# EAGLE design 20180608-iot (EAGLE 9.3.1)
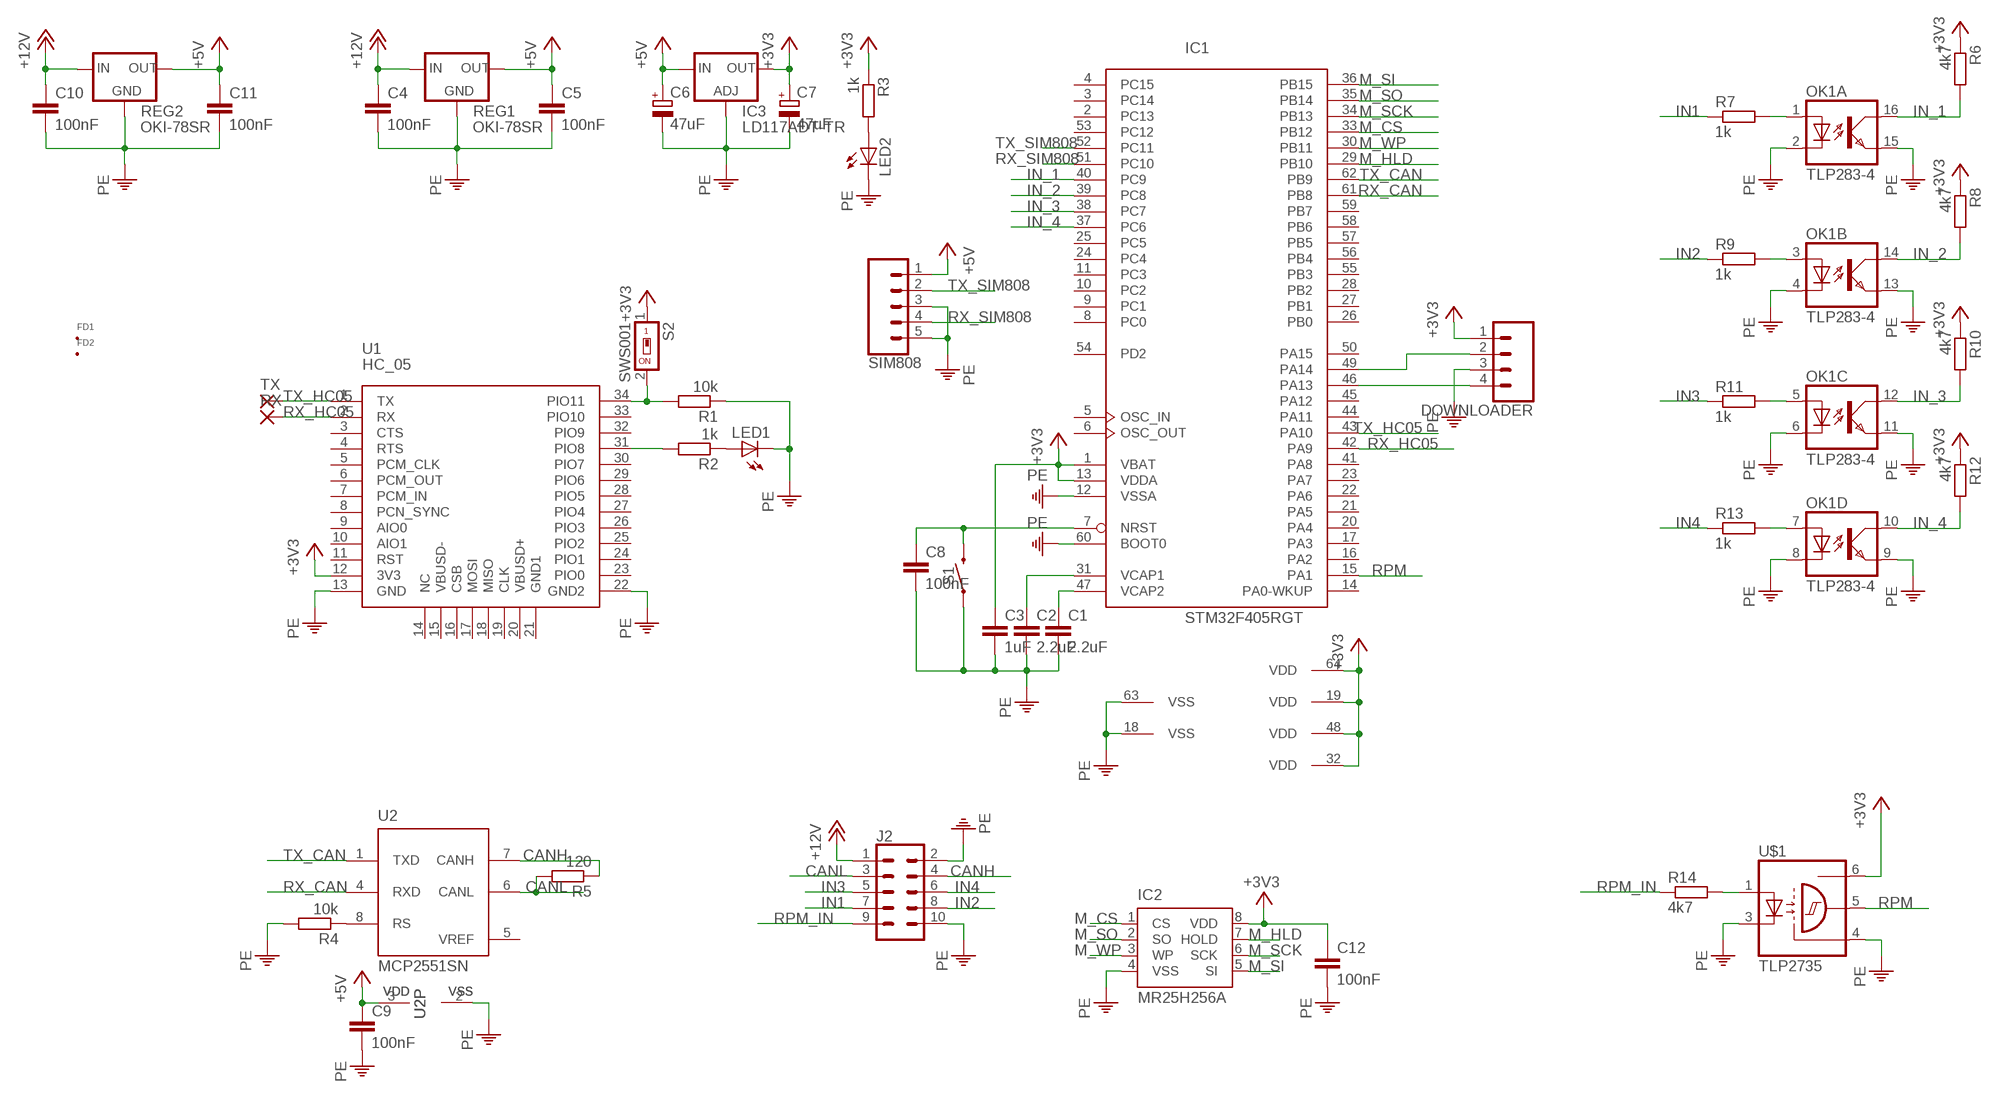
[diagram p0: schematic, sheet 1]

## Parts
C1  2.2uF  C-EUC0805  [C0805]
C2  2.2uF  C-EUC0805  [C0805]
C3  1uF  C-EUC0805  [C0805]
C4  100nF  C-EUC0805  [C0805]
C5  100nF  C-EUC0805  [C0805]
C6  47uF  CPOL-EUCT7343  [CT7343]
C7  47uF  CPOL-EUCT7343  [CT7343]
C8  100nF  C-EUC0805  [C0805]
C9  100nF  C-EUC0805  [C0805]
C10  100nF  C-EUC0805  [C0805]
C11  100nF  C-EUC0805  [C0805]
C12  100nF  C-EUC0805  [C0805]
DOWNLOADER  CONN_04  [1X04]
FD1  FID_40MIL  [FID_040]
FD2  FID_40MIL  [FID_040]
IC1  STM32F405RGT  [LQFP64]
IC2  MR25H256A  [SON127P600X500X90-9T210]
IC3  LD117ADT-TR  [DPACK]
J2  CONN_05X2  [2X5-EDGE_SMD]
LED1  LEDCHIP-LED0805  [CHIP-LED0805]
LED2  LEDCHIP-LED0805  [CHIP-LED0805]
OK1  TLP283-4  [MINI-FLAT-16]
R1  10k  R-EU_R0805  [R0805]
R2  1k  R-EU_R0805  [R0805]
R3  1k  R-EU_R0805  [R0805]
R4  10k  R-EU_R0805  [R0805]
R5  120  R-EU_R0805  [R0805]
R6  4k7  R-EU_R0805  [R0805]
R7  1k  R-EU_R0805  [R0805]
R8  4k7  R-EU_R0805  [R0805]
R9  1k  R-EU_R0805  [R0805]
R10  4k7  R-EU_R0805  [R0805]
R11  1k  R-EU_R0805  [R0805]
R12  4k7  R-EU_R0805  [R0805]
R13  1k  R-EU_R0805  [R0805]
R14  4k7  R-EU_R0805  [R0805]
REG1  OKI-78SR  [HDRV3W64P254_1X3_1195X508X838B]
REG2  OKI-78SR  [HDRV3W64P254_1X3_1195X508X838B]
RX  SMD2  [SMD1,27-2,54]
S1  MOMENTARY-SWITCH-SPST-SMD-6.0X3.5MM  [TACTILE_SWITCH_SMD_6.0X3.5MM]
S2  SWS001  [SMS-001]
SIM808  CONN_05  [1X05]
TX  SMD2  [SMD1,27-2,54]
U1  HC_05  [BLUETOOTH_SMD]
U2  MCP2551SN  [SO-08]
U$1  TLP2735  [SOIC127P1000X210-6]

## Nets
+3V3: C3.1 C7.+ C12.1 DOWNLOADER.1 IC1.1(VBAT) IC1.13(VDDA) IC1.19(VDD) IC1.32(VDD) IC1.48(VDD) IC1.64(VDD) IC2.8(VDD) IC3.4(OUT) R3.1 R6.1 R8.1 R10.1 R12.1 S2.1 U1.12(3V3) U$1.6(VCC)
+5V: C5.1 C6.+ C9.1 C11.1 IC3.3(IN) REG1.3(OUT) REG2.3(OUT) SIM808.1 U2.3(VDD)
+12V: C4.1 C10.1 J2.1 REG1.1(IN) REG2.1(IN)
CANH: J2.4 R5.1 U2.7(CANH)
CANL: J2.3 R5.2 U2.6(CANL)
IN1: J2.7 R7.1
IN2: J2.8 R9.1
IN3: J2.5 R11.1
IN4: J2.6 R13.1
IN_1: IC1.40(PC9) OK1.16(A:COL) R6.2
IN_2: IC1.39(PC8) OK1.14(B:COL) R8.2
IN_3: IC1.38(PC7) OK1.12(C:COL) R10.2
IN_4: IC1.37(PC6) OK1.10(D:COL) R12.2
M_CS: IC1.33(PB12) IC2.1(CS)
M_HLD: IC1.29(PB10) IC2.7(HOLD)
M_SCK: IC1.34(PB13) IC2.6(SCK)
M_SI: IC1.36(PB15) IC2.5(SI)
M_SO: IC1.35(PB14) IC2.2(SO)
M_WP: IC1.30(PB11) IC2.3(WP)
N$1: DOWNLOADER.2 IC1.49(PA14)
N$2: DOWNLOADER.4 IC1.46(PA13)
N$3: C1.1 IC1.47(VCAP2)
N$4: C2.1 IC1.31(VCAP1)
N$5: C8.1 IC1.7(NRST) S1.2
N$6: LED1.A R2.1
N$7: R1.2 S2.2 U1.34(PIO11)
N$8: R2.2 U1.31(PIO8)
N$9: LED2.A R3.2
N$10: R4.1 U2.8(RS)
N$13: OK1.1(A:A) R7.2
N$14: R14.2 U$1.1(A)
N$16: OK1.3(B:A) R9.2
N$18: OK1.5(C:A) R11.2
N$21: OK1.7(D:A) R13.2
PE: C1.2 C2.2 C3.2 C4.2 C5.2 C6.- C7.- C8.2 C9.2 C10.2 C11.2 C12.2 DOWNLOADER.3 IC1.12(VSSA) IC1.18(VSS) IC1.60(BOOT0) IC1.63(VSS) IC2.4(VSS) IC3.1(ADJ) J2.2 J2.10 LED1.C LED2.C OK1.2(A:C) OK1.4(B:C) OK1.6(C:C) OK1.8(D:C) OK1.9(D:EMIT) OK1.11(C:EMIT) OK1.13(B:EMIT) OK1.15(A:EMIT) R1.1 R4.2 REG1.2(GND) REG2.2(GND) S1.1 SIM808.3 SIM808.5 U1.13(GND) U1.22(GND2) U2.2(VSS) U$1.3(C) U$1.4(GND)
RPM: IC1.15(PA1) U$1.5(OUT)
RPM_IN: J2.9 R14.1
RX_CAN: IC1.61(PB8) U2.4(RXD)
RX_HC05: IC1.42(PA9) RX.1(P) U1.2(RX)
RX_SIM808: IC1.51(PC10) SIM808.4
TX_CAN: IC1.62(PB9) U2.1(TXD)
TX_HC05: IC1.43(PA10) TX.1(P) U1.1(TX)
TX_SIM808: IC1.52(PC11) SIM808.2
Unconnected: IC1.2(PC13) IC1.3(PC14) IC1.4(PC15) IC1.5(OSC_IN) IC1.6(OSC_OUT) IC1.8(PC0) IC1.9(PC1) IC1.10(PC2) IC1.11(PC3) IC1.14(PA0-WKUP) IC1.16(PA2) IC1.17(PA3) IC1.20(PA4) IC1.21(PA5) IC1.22(PA6) IC1.23(PA7) IC1.24(PC4) IC1.25(PC5) IC1.26(PB0) IC1.27(PB1) IC1.28(PB2) IC1.41(PA8) IC1.44(PA11) IC1.45(PA12) IC1.50(PA15) IC1.53(PC12) IC1.54(PD2) IC1.55(PB3) IC1.56(PB4) IC1.57(PB5) IC1.58(PB6) IC1.59(PB7) U1.3(CTS) U1.4(RTS) U1.5(PCM_CLK) U1.6(PCM_OUT) U1.7(PCM_IN) U1.8(PCN_SYNC) U1.9(AIO0) U1.10(AIO1) U1.11(RST) U1.14(NC) U1.15(VBUSD-) U1.16(CSB) U1.17(MOSI) U1.18(MISO) U1.19(CLK) U1.20(VBUSD+) U1.21(GND1) U1.23(PIO0) U1.24(PIO1) U1.25(PIO2) U1.26(PIO3) U1.27(PIO4) U1.28(PIO5) U1.29(PIO6) U1.30(PIO7) U1.32(PIO9) U1.33(PIO10)

## Power pins joined to a net without a drawn wire
VREF: U2.5(VREF)

## Library data of the parts
C1-C5 C8-C12 = rcl:C-EU: CAPACITOR, European symbol; SPICEPREFIX: C
C6 C7 = rcl:CPOL-EU: POLARIZED CAPACITOR, European symbol; SPICEPREFIX: C
DOWNLOADER = SparkFun-Connectors:CONN_04: Multi connection point. Often used as Generic Header-pin footprint for 0.1 inch spaced/style header connections On any of the 0.1 inch spaced packages, you can populate with these: Break Away Headers - Straight <https://www.sparkfun.com/products/116> (PRT-00116) Break Away Male Headers - Right Angle <https://www.sparkfun.com/products/553> (PRT-00553) Female Headers <https://www.sparkfun.com/products/115> (PRT-00115) Break Away Headers - Machine Pin <https://www.sparkfun.com/products/117> (PRT-00117) Break Away Female Headers - Swiss Machine Pin <https://www.sparkfun.com/products/743> (PRT-00743) For SCREWTERMINALS and SPRING TERMINALS visit here: Screw Terimnals on SparkFun.com <https://www.sparkfun.com/search/results?term=Screw+Terminals> (5mm/3.5mm/2.54mm spacing) This device is also useful as a general connection point to wire up your design to another part of your project. Our various solder wires solder well into these plated through hole pads. Hook-Up Wire - Assortment (Stranded, 22 AWG) <https://www.sparkfun.com/products/11375> (PRT-11375) Hook-Up Wire - Assortment (Solid Core, 22 AWG) <https://www.sparkfun.com/products/11367> (PRT-11367) View the entire wire category on our website here <https://www.sparkfun.com/categories/141> Special notes: Molex polarized connector foot print use with SKU : PRT-08231 with associated crimp pins and housings. 1MM SMD Version SKU: PRT-10208; PROD_ID: CONN-09696
FD1 FD2 = Fiducial A:FID: Fiducial marks. Top and Bottom copper with stop mask
IC1 = micro-stm_v3:STM32F405R*T: ARM 32-bit Cortex™-M3 CPU 168 MHz maximum frequency 1024 Kbytes of Flash memory 192 kbytes of SRAM 51 GPIOs 1.8 to 3.6 V application supply; SPICEPREFIX: X
IC2 = my:MR25H256A
IC3 = v-reg:LD117A?*: Low drop fixed and adjustable positive voltage regulators 1 A Source: http://www.st.com/stonline/products/literature/ds/7194/ld1117axx.pdf
J2 = edge-con:CONN_05X2: Multi connection point. Often used as Generic Header-pin footprint for 0.1 inch spaced/style header connections For AVR SPI programming port, see special device with nice symbol: "AVR_SPI_PROG_5x2.dev" You can populate with any combo of single row headers, but if you'd like an exact match, check these: 2x5 AVR ICSP Male Header <https://www.sparkfun.com/products/778> (PRT-00778) 2x5 Pin Shrouded Header <https://www.sparkfun.com/products/8506> (PRT-08506) On any of the 0.1 inch spaced packages, you can populate with these: Break Away Headers - Straight <https://www.sparkfun.com/products/116> (PRT-00116) Break Away Male Headers - Right Angle <https://www.sparkfun.com/products/553> (PRT-00553) Female Headers <https://www.sparkfun.com/products/115> (PRT-00115) Break Away Headers - Machine Pin <https://www.sparkfun.com/products/117> (PRT-00117) Break Away Female Headers - Swiss Machine Pin <https://www.sparkfun.com/products/743> (PRT-00743) Special note: the shrouded connector mates well with our 5x2 ribbon cables: 2x5 Pin IDC Ribbon Cable <https://www.sparkfun.com/products/8535> (PRT-08535)
LED1 LED2 = led:LED: LED OSRAM: - CHIPLED LG R971, LG N971, LY N971, LG Q971, LY Q971, LO R971, LY R971 LH N974, LH R974 LS Q976, LO Q976, LY Q976 LO Q996 - Hyper CHIPLED LW Q18S LB Q993, LB Q99A, LB R99A - SideLED LS A670, LO A670, LY A670, LG A670, LP A670 LB A673, LV A673, LT A673, LW A673 LH A674 LY A675 LS A676, LA A676, LO A676, LY A676, LW A676 LS A679, LY A679, LG A679 - Hyper Micro SIDELED® LS Y876, LA Y876, LO Y876, LY Y876 LT Y87S - SmartLED LW L88C, LW L88S LB L89C, LB L89S, LG L890 LS L89K, LO L89K, LY L89K LS L896, LA L896, LO L896, LY L896 - TOPLED LS T670, LO T670, LY T670, LG T670, LP T670 LSG T670, LSP T670, LSY T670, LOP T670, LYG T670 LG T671, LOG T671, LSG T671 LB T673, LV T673, LT T673, LW T673 LH T674 LS T676, LA T676, LO T676, LY T676, LB T676, LH T676, LSB T676, LW T676 LB T67C, LV T67C, LT T67C, LS T67K, LO T67K, LY T67K, LW E67C LS E67B, LA E67B, LO E67B, LY E67B, LB E67C, LV E67C, LT E67C LW T67C LS T679, LY T679, LG T679 LS T770, LO T770, LY T770, LG T770, LP T770 LB T773, LV T773, LT T773, LW T773 LH T774 LS E675, LA E675, LY E675, LS T675 LS T776, LA T776, LO T776, LY T776, LB T776 LHGB T686 LT T68C, LB T68C - Hyper Mini TOPLED® LB M676 - Mini TOPLED Santana® LG M470 LS M47K, LO M47K, LY M47K Source: http://www.osram.convergy.de LUXEON: - LUMILED® LXK2-PW12-R00, LXK2-PW12-S00, LXK2-PW14-U00, LXK2-PW14-V00 LXK2-PM12-R00, LXK2-PM12-S00, LXK2-PM14-U00 LXK2-PE12-Q00, LXK2-PE12-R00, LXK2-PE12-S00, LXK2-PE14-T00, LXK2-PE14-U00 LXK2-PB12-K00, LXK2-PB12-L00, LXK2-PB12-M00, LXK2-PB14-N00, LXK2-PB14-P00, LXK2-PB14-Q00 LXK2-PR12-L00, LXK2-PR12-M00, LXK2-PR14-Q00, LXK2-PR14-R00 LXK2-PD12-Q00, LXK2-PD12-R00, LXK2-PD12-S00 LXK2-PH12-R00, LXK2-PH12-S00 LXK2-PL12-P00, LXK2-PL12-Q00, LXK2-PL12-R00 Source: www.luxeon.com KINGBRIGHT: KA-3528ASYC Source: www.kingbright.com
OK1 = optocoupler:TLP283-4: TOSHIBA PHOTOCOUPLER GaAs IRED & PHOTO-TRANSISTOR Source: http://www.semicon.toshiba.co.jp/td/en/Opto/Photocoupler/en_20050928_TLP283_datasheet.pdf; OC_FARNELL: unknown; OC_NEWARK: unknown
R1-R14 = rcl:R-EU_: RESISTOR, European symbol; SPICEPREFIX: R
REG1 REG2 = my:OKI-78SR
RX TX = wirepad:SMD2: SMD PAD
S1 = SparkFun-Switches:MOMENTARY-SWITCH-SPST: Momentary Switch (Pushbutton) - SPST Normally-open (NO) SPST momentary switches (buttons, pushbuttons). Variants PTH-12MM - 12mm square, through-hole Momentary Pushbutton Switch - 12mm Square <https://www.sparkfun.com/products/9190> (COM-09190) PTH-6.0MM, PTH-6.0MM-KIT - 6.0mm square, through-hole Mini Pushbutton Switch <https://www.sparkfun.com/products/97> (COM-00097) KIT package intended for soldering kit's - only one side of pads' copper is exposed. PTH-RIGHT-ANGLE-KIT - Right-angle, through-hole Right Angle Tactile Button <https://www.sparkfun.com/products/10791> - Used on SparkFun BigTime Watch Kit <https://www.sparkfun.com/products/11734> SMD-12MM - 12mm square, surface-mount Tactile Button - SMD (12mm) <https://www.sparkfun.com/products/12993> (COM-12993) Used on SparkFun PicoBoard <https://www.sparkfun.com/products/11888> SMD-4.5MM - 4.5mm Square Trackball Switch Used on SparkFun Blackberry Trackballer Breakout <https://www.sparkfun.com/products/13169> SMD-4.6MMX2.8MM - 4.60mm x 2.80mm, surface mount Used on SparkFun SAMD21 Mini Breakout <https://www.sparkfun.com/products/13664> SMD-5.2MM, SMD-5.2-REDUNDANT - 5.2mm square, surface-mount Mini Pushbutton Switch - SMD <https://www.sparkfun.com/products/8720> (COM-08720) Used on Arduino Pro Mini <https://www.sparkfun.com/products/11114> REDUNDANT package connects both switch circuits together SMD-6.0X3.5MM - 6.0 x 3.5mm, surface mount Momentary Reset Switch SMD <https://www.sparkfun.com/products/8229> (COM-08229) SMD-6.2MM-TALL - 6.2mm square, surface mount Tactile Button - SMD (6mm) <https://www.sparkfun.com/products/12992> Used on SparkFun Digital Sandbox <https://www.sparkfun.com/products/12651> SMD-RIGHT-ANGLE - Right-angle, surface mount Used on SparkFun Block for Intel® Edison - Arduino <https://www.sparkfun.com/products/13036>; PROD_ID: SWCH-00815; SF_SKU: COM-08229
S2 = smd-special:SWS001: SMD Dip Switch 1 pol.
SIM808 = SparkFun-Connectors:CONN_05: Multi connection point. Often used as Generic Header-pin footprint for 0.1 inch spaced/style header connections On any of the 0.1 inch spaced packages, you can populate with these: Break Away Headers - Straight <https://www.sparkfun.com/products/116> (PRT-00116) Break Away Male Headers - Right Angle <https://www.sparkfun.com/products/553> (PRT-00553) Female Headers <https://www.sparkfun.com/products/115> (PRT-00115) Break Away Headers - Machine Pin <https://www.sparkfun.com/products/117> (PRT-00117) Break Away Female Headers - Swiss Machine Pin <https://www.sparkfun.com/products/743> (PRT-00743) For SCREWTERMINALS and SPRING TERMINALS visit here: Screw Terimnals on SparkFun.com <https://www.sparkfun.com/search/results?term=Screw+Terminals> (5mm/3.5mm/2.54mm spacing) This device is also useful as a general connection point to wire up your design to another part of your project. Our various solder wires solder well into these plated through hole pads. Hook-Up Wire - Assortment (Stranded, 22 AWG) <https://www.sparkfun.com/products/11375> (PRT-11375) Hook-Up Wire - Assortment (Solid Core, 22 AWG) <https://www.sparkfun.com/products/11367> (PRT-11367) View the entire wire category on our website here <https://www.sparkfun.com/categories/141> Special notes: Molex polarized connector foot print use with SKU : PRT-08231 with associated crimp pins and housings. 1MM SMD Version SKU: PRT-10208
U1 = Bluetooth HC-05:HC_05: HC-05 Bluetooth Module
U2 = microchip_can:MCP2551: High Speed CAN tranceiver; SPICEPREFIX: X
U$1 = tlp2735:TLP2735: The Toshiba TLP2735 consists of high-output GaAℓAs light-emitting diode coupled with a high-gain, high-speed photo detector. It is housed in a thin SO6L package of 2.3 mm (max). The TLP2735 has guaranteed the isolation voltage 5 kVrms and compliant with international safety standards for reinforced insulation. This product can operate in power supply voltage 9 V to 15 V with the maximum operating temperature of 125 C. Since TLP2735 has UVLO function, it can prevent false operation during VDD starting up or under low voltage condition. The detector has a totem-pole output stage with current sourcing and sinking capabilities. The TLP2735 has an internal Faraday shield that provides a guaranteed common-mode transient immunity of ±25 kV/µs.

## Board
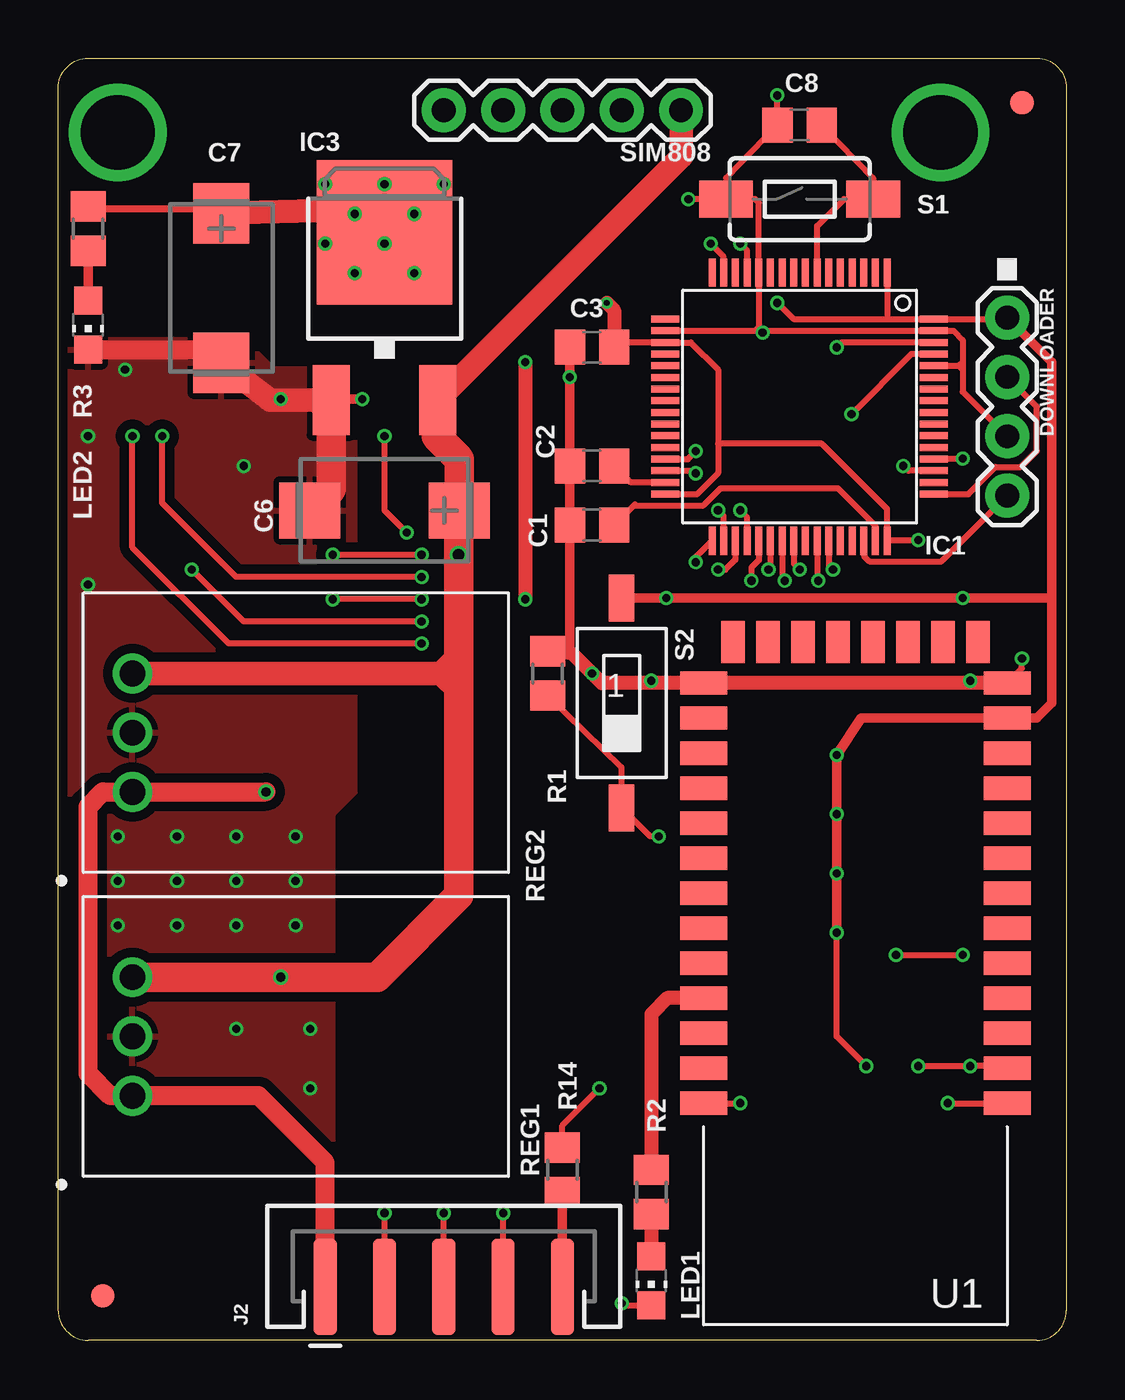
[diagram p1: board, top side]
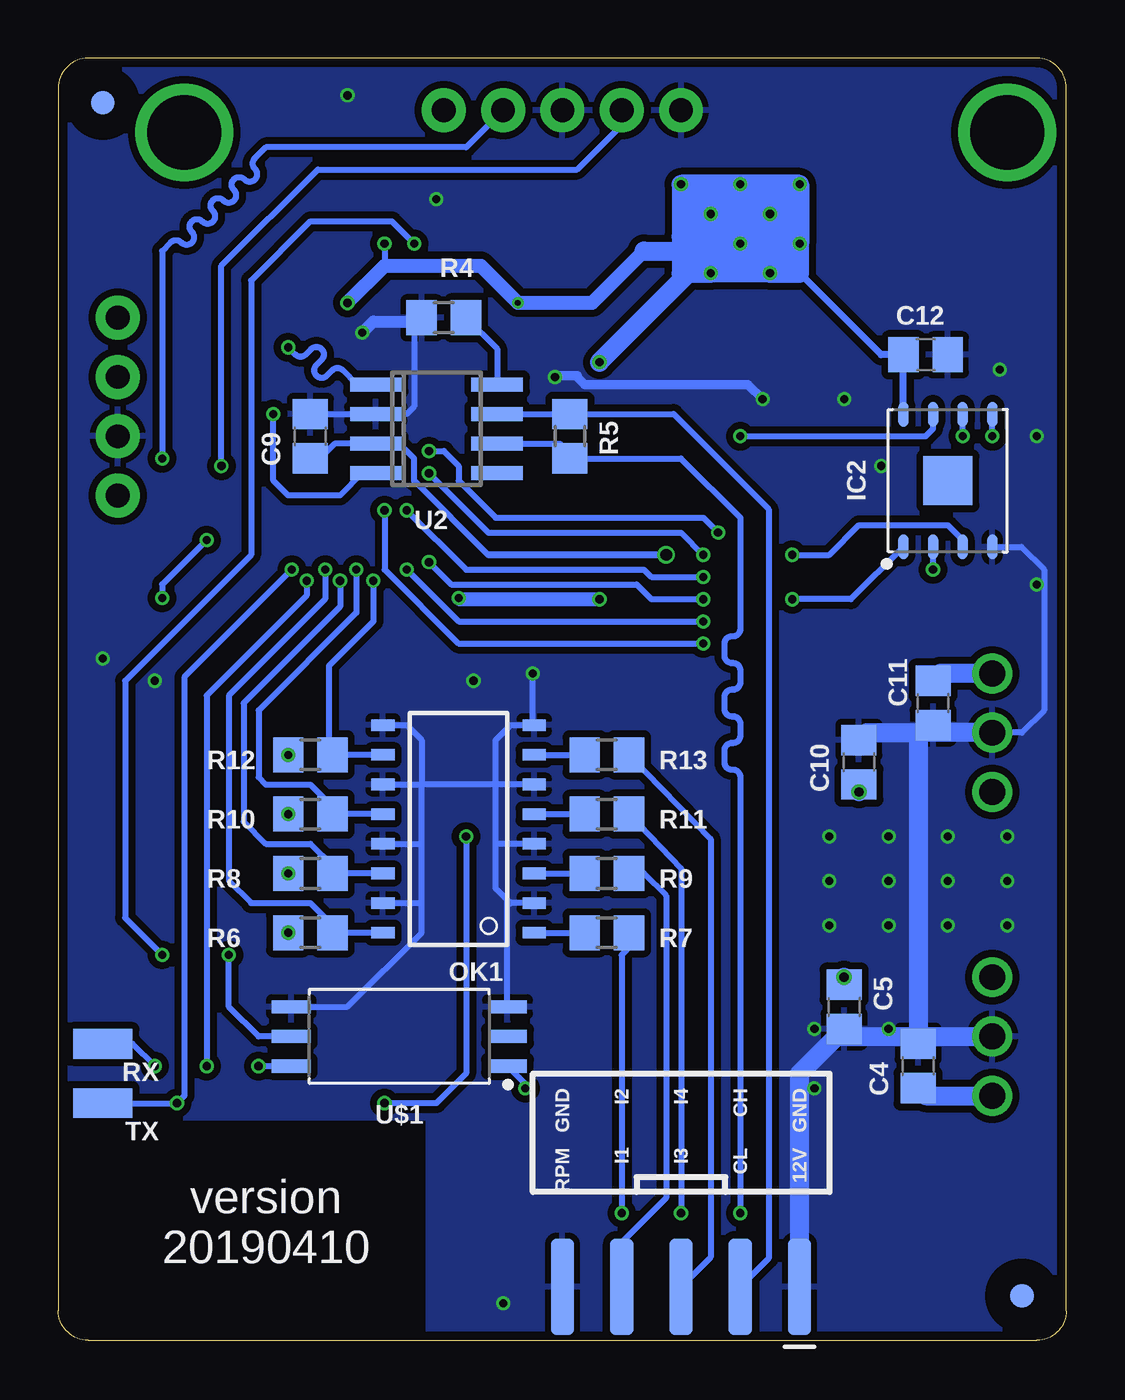
[diagram p2: board, bottom side, seen from below]

Size 43.18 x 54.93 mm. Coordinates in mm from the lower left corner, seen from the top.
Outline: 1.27,54.93 41.91,54.93 arc-90 43.18,53.66 43.18,1.27 arc-90 41.91,0 1.27,0 arc-90 0,1.27 0,53.66 arc-90 1.27,54.93
Copper layers (1*16): Top 0.035559375mm / dielectric 1.6mm / Bottom 0.035559375mm
Design rules "oshpark-2layer": minimum track width 6mil, minimum drill 10mil, track to track 6mil, track to pad 6mil, pad to pad 6mil, via to via 6mil, smd to smd 6mil, copper to edge 15mil, drill to drill 6mil, minimum pad ring 5mil, minimum via ring 5mil, stop-mask expansion 2.5mil, vias tented up to drill 0mil, thermal gap 10mil

### Footprints (pad centres in the part's own frame; a part is rotated, then mirrored left to right if it is on the bottom)
C0805 = smd 1.3 x 1.5: 1 -0.95,0; 2 0.95,0
CT7343 = smd 2.6 x 2.4: + -3.2,0; - 3.2,0
1X04 = drill 1.016 pad 1.88: 1 0,0; 2 2.54,0; 3 5.08,0; 4 7.62,0
FID_040 = smd 1.016 x 1.016 bottom: FIDB 0,0 | smd 1.016 x 1.016: FIDT 0,0
LQFP64 = smd 0.3 x 1.2: 1 -3.75,-5.75; 2 -3.25,-5.75; 3 -2.75,-5.75; 4 -2.25,-5.75; 5 -1.75,-5.75; 6 -1.25,-5.75; 7 -0.75,-5.75; 8 -0.25,-5.75; 9 0.25,-5.75; 10 0.75,-5.75; 11 1.25,-5.75; 12 1.75,-5.75; 13 2.25,-5.75; 14 2.75,-5.75; 15 3.25,-5.75; 16 3.75,-5.75; 33 3.75,5.75; 34 3.25,5.75; 35 2.75,5.75; 36 2.25,5.75; 37 1.75,5.75; 38 1.25,5.75; 39 0.75,5.75; 40 0.25,5.75; 41 -0.25,5.75; 42 -0.75,5.75; 43 -1.25,5.75; 44 -1.75,5.75; 45 -2.25,5.75; 46 -2.75,5.75; 47 -3.25,5.75; 48 -3.75,5.75 | smd 1.2 x 0.3: 17 5.75,-3.75; 18 5.75,-3.25; 19 5.75,-2.75; 20 5.75,-2.25; 21 5.75,-1.75; 22 5.75,-1.25; 23 5.75,-0.75; 24 5.75,-0.25; 25 5.75,0.25; 26 5.75,0.75; 27 5.75,1.25; 28 5.75,1.75; 29 5.75,2.25; 30 5.75,2.75; 31 5.75,3.25; 32 5.75,3.75; 49 -5.75,3.75; 50 -5.75,3.25; 51 -5.75,2.75; 52 -5.75,2.25; 53 -5.75,1.75; 54 -5.75,1.25; 55 -5.75,0.75; 56 -5.75,0.25; 57 -5.75,-0.25; 58 -5.75,-0.75; 59 -5.75,-1.25; 60 -5.75,-1.75; 61 -5.75,-2.25; 62 -5.75,-2.75; 63 -5.75,-3.25; 64 -5.75,-3.75
SON127P600X500X90-9T210 = smd 1.06 x 0.42: 1 -2.835,1.905; 2 -2.835,0.635; 3 -2.835,-0.635; 4 -2.835,-1.905; 5 2.835,-1.905; 6 2.835,-0.635; 7 2.835,0.635; 8 2.835,1.905 | smd 2.1 x 2.1: 9 0,0
DPACK = smd 1.6 x 3: 1 -2.28,-4.8; 3 2.28,-4.8 | smd 5.8 x 6.2: 4 0,2.38
2X5-EDGE_SMD = smd 4.15 x 1: 1 -2.794,5.08; 3 -2.794,2.54; 5 -2.794,0; 7 -2.794,-2.54; 9 -2.794,-5.08 | smd 4.15 x 1 bottom: 2 -2.794,5.08; 4 -2.794,2.54; 6 -2.794,0; 8 -2.794,-2.54; 10 -2.794,-5.08
CHIP-LED0805 = smd 1.2 x 1.2: A 0,-1.05; C 0,1.05
MINI-FLAT-16 = smd 1 x 0.5: 1 -3.24,4.445; 2 -3.24,3.175; 3 -3.24,1.905; 4 -3.24,0.635; 5 -3.24,-0.635; 6 -3.24,-1.905; 7 -3.24,-3.175; 8 -3.24,-4.445; 9 3.24,-4.445; 10 3.24,-3.175; 11 3.24,-1.905; 12 3.24,-0.635; 13 3.24,0.635; 14 3.24,1.905; 15 3.24,3.175; 16 3.24,4.445
R0805 = smd 1.3 x 1.5: 1 -0.95,0; 2 0.95,0
HDRV3W64P254_1X3_1195X508X838B = drill 1.105 pad 1.705: 1 0,0; 2 2.54,0; 3 5.08,0
SMD1,27-2,54 = smd 1.27 x 2.54: 1 0,0
TACTILE_SWITCH_SMD_6.0X3.5MM = smd 2.3 x 1.6: 1 -3.15,0; 2 3.15,0
SMS-001 = smd 1.092 x 2.007: 1 0,-4.496; 2 0,4.496
1X05 = drill 1.016 pad 1.88: 1 0,0; 2 2.54,0; 3 5.08,0; 4 7.62,0; 5 10.16,0
BLUETOOTH_SMD = smd 2 x 1: 1 -6.35,3.81; 2 -6.35,2.31; 3 -6.35,0.81; 4 -6.35,-0.69; 5 -6.35,-2.19; 6 -6.35,-3.69; 7 -6.35,-5.19; 8 -6.35,-6.69; 9 -6.35,-8.19; 10 -6.35,-9.69; 11 -6.35,-11.19; 12 -6.35,-12.69; 13 -6.35,-14.19; 22 6.65,-14.19; 23 6.65,-12.69; 24 6.65,-11.19; 25 6.65,-9.69; 26 6.65,-8.19; 27 6.65,-6.69; 28 6.65,-5.19; 29 6.65,-3.69; 30 6.65,-2.19; 31 6.65,-0.69; 32 6.65,0.81; 33 6.65,2.31; 34 6.65,3.81 | smd 1 x 1.8: 14 -5.1,-15.94; 15 -3.6,-15.94; 16 -2.1,-15.94; 17 -0.6,-15.94; 18 0.9,-15.94; 19 2.4,-15.94; 20 3.9,-15.94; 21 5.4,-15.94
SO-08 = smd 0.6 x 2.2: 1 -1.905,-2.6; 2 -0.635,-2.6; 3 0.635,-2.6; 4 1.905,-2.6; 5 1.905,2.6; 6 0.635,2.6; 7 -0.635,2.6; 8 -1.905,2.6
SOIC127P1000X210-6 = smd 1.653 x 0.569: 1 -4.631,1.27; 2 -4.631,0; 3 -4.631,-1.27; 4 4.631,-1.27; 5 4.631,0; 6 4.631,1.27

### Placement (x,y rotation side)
C1  22.86,34.92 180 top
C2  22.86,37.47 180 top
C3  22.86,42.55 180 top
C4  6.35,11.75 90 bottom
C5  9.53,14.29 270 bottom
C6  13.97,35.56 180 top
C7  6.99,45.09 270 top
C8  31.75,52.07 180 top
C9  32.38,38.73 90 bottom
C10  8.89,24.77 90 bottom
C11  5.71,27.3 270 bottom
C12  6.03,42.23 0 bottom
DOWNLOADER  40.64,43.81 270 top
FD1  1.91,1.91 0 top
FD2  41.27,53.02 0 top
IC1  31.75,40.01 180 top
IC2  5.08,36.83 90 bottom
IC3  13.97,45.09 0 top
J2  16.51,5.08 90 top
LED1  25.4,2.54 180 top
LED2  1.27,43.5 180 top
OK1  26.04,21.91 180 bottom
R1  20.95,28.57 270 top
R2  25.4,6.35 90 top
R3  1.27,47.62 270 top
R4  26.67,43.81 180 bottom
R5  21.27,38.73 270 bottom
R6  32.38,17.46 0 bottom
R7  19.68,17.46 180 bottom
R8  32.38,20 0 bottom
R9  19.68,20 180 bottom
R10  32.38,22.54 0 bottom
R11  19.68,22.54 180 bottom
R12  32.38,25.08 0 bottom
R13  19.68,25.08 180 bottom
R14  21.59,7.3 90 top
REG1  3.17,10.48 90 top
REG2  3.17,23.5 90 top
RX  41.27,12.7 90 bottom
S1  31.75,48.9 0 top
S2  24.13,27.3 180 top
SIM808  26.67,52.7 180 top
TX  41.27,10.16 90 bottom
U1  34.29,13.97 180 top
U2  26.99,39.05 270 bottom
U$1  28.57,13.02 180 bottom

### Tracks (layer width: path | path; a pad name or v marks a point on that pad's centre or on a via)
+3V3  (via drill 0.25, 0.35)
  Top 0.254: 35.56,43.76 IC1.64 40.58,43.76 DOWNLOADER.1 | IC1.1 35.5,43.81 35.56,43.76 | 23.81,42.62 C3.1 23.95,42.76 IC1.19 27.09,42.76 28.26,41.59 28.26,38.42 | 14.45,46.99 IC3.4 v13.97,46.99 | v30.8,44.45 31.49,43.76 35.56,43.76 | R12.1 | C7.+ 6.3,48.47 | v36.83,34.29 35.53,34.29 IC1.48 35.5,35.62 32.7,38.42 28.26,38.42 | v34.61,11.75 33.34,13.02 R6.1 | IC1.32 27.36,36.26 28.26,37.15 28.26,38.42 | IC1.13 29.5,46.7 v29.21,46.99
  Top 0.305: 6.3,48.47 1.37,48.47 R3.1
  Top 0.406: 42.55,31.75 42.55,27.3 41.9,26.66 U1.12 34.4,26.66 R12.1 R10.1 R8.1 R6.1 | 42.55,31.75 42.55,41.91 DOWNLOADER.1 | S2.1 v26.04,31.8 v38.73,31.8 42.49,31.8 42.55,31.75
  Top 0.61: U1.12 | v23.5,44.45 23.81,44.13 C3.1 | v20,41.91 v20,31.75
  Top 1.016: 13.34,48.09 IC3.4 13.81,47.62 12.7,47.62 11.9,48.42 C7.+
  Bottom 0.254: 33.23,17.04 R6.1 | v36.83,34.29 38.73,32.38 v38.73,31.8 38.73,31.75 | v34.61,11.75 U$1.6 | v29.21,46.99 29.21,46.04
  Bottom 0.305: IC2.8 C12.1 7.94,42.23 11.43,45.72
  Bottom 0.61: v30.8,44.45 29.21,46.04 25.08,46.04 v23.5,44.45 20.32,44.45 18.1,46.67 | v26.04,31.8 25.98,31.75 v20,31.75
  Bottom 0.813: v20,41.91 16.19,45.72 v15.24,45.72 | 12.06,49.53 v11.43,49.53 v11.43,46.99 | 12.06,49.53 12.7,49.53 | 12.7,49.53 v13.97,49.53 v16.51,49.53 16.51,47.31 | v15.24,48.26 v12.7,48.26 12.7,48.9 | v11.43,46.99 v13.97,46.99 15.56,46.99 15.72,46.83 | v12.7,45.72 v15.24,45.72 | 12.7,48.9 12.7,49.53 | 16.51,47.31 16.51,45.72 v15.24,45.72 | v15.24,45.72 16.19,46.67 18.1,46.67 | 12.06,49.53 12.06,47.62 15.88,47.62 15.88,48.9 12.7,48.9 | v11.43,46.99 11.43,45.72 v12.7,45.72 | v12.7,45.72 12.06,46.35 15.24,46.35 15.72,46.83 | 15.72,46.83 16.19,47.31 16.51,47.31
  other vias: 33.34,17.46 33.34,25.08 33.34,22.54 33.34,20
+5V  (via drill 0.4, 0.5)
  Top 0.254: 16.83,27.62 16.19,28.26 16.19,28.89 16.83,29.53 17.14,29.53
  Top 0.508: C6.+ 17.22,35.51
  Top 0.61: 16.19,40.14 16.3,40.24
  Top 1.016: 16.37,40.06 arc45 16.3,40.24 IC3.3 26.67,50.7 SIM808.1 | REG2.3 17.14,28.57
  Top 1.27: 16.19,40.14 16.19,38.73 17.17,37.76 C6.+ 17.14,35.53 v17.14,33.66 17.14,29.53 17.14,28.57 17.14,19.05 13.65,15.56 v9.53,15.56 REG1.3
  Bottom 0.254: 24.77,33.66 27.94,36.83 27.94,37.78 28.57,38.42 U2.3 31.34,38.42 31.98,37.78 C9.1
  Bottom 0.305: v17.14,33.66 24.77,33.66
  Bottom 0.813: C5.1 v9.53,15.56 | REG2.3 5.39,28.57 C11.1
+12V  (via drill 0.4)
  Top 0.813: J2.1 11.43,7.62 8.57,10.48 6.35,10.48 REG1.1 2.22,10.48 1.27,11.43 1.27,22.86 1.91,23.5 REG2.1 v8.89,23.5
  Bottom 0.813: C4.1 6.03,10.48 REG1.1 | v8.89,23.5 C10.1
CANH
  Bottom 0.254: U2.7 21.8,39.69 21.49,39.37 | 21.49,39.37 R5.1 16.82,39.69 12.75,35.61 12.75,3.5 J2.4 | 21.49,39.37 21.42,39.3
CANL  (via drill 0.35)
  Top 0.254: J2.3 v13.97,5.45
  Bottom 0.254: U2.6 21.7,38.42 R5.2 16.51,37.78 13.97,35.24 13.97,30.48 arc90 14.29,30.16 14.33,30.16 arc-90 14.65,29.84 14.65,29.34 arc-90 14.33,29.02 14.29,29.02 arc90 13.97,28.7 13.97,28.19 arc90 14.29,27.88 14.33,27.88 arc-90 14.65,27.56 14.65,27.05 arc-90 14.33,26.73 14.29,26.73 arc90 13.97,26.42 13.97,25.91 arc90 14.29,25.59 14.33,25.59 arc-90 14.65,25.27 14.65,24.77 arc-90 14.33,24.45 14.29,24.45 arc90 13.97,24.13 v13.97,5.45
IN1  (via drill 0.35)
  Top 0.254: J2.7 v19.05,5.45
  Bottom 0.254: R7.1 18.84,16.73 19.05,16.51 v19.05,5.45 19.05,5.4
IN2
  Bottom 0.254: J2.8 19.05,4.19 17.14,6.1 17.14,19.05 18.1,20 R9.1
IN3  (via drill 0.35)
  Top 0.254: J2.5 v16.51,5.45
  Bottom 0.254: R11.1 16.51,20.22 v16.51,5.45 16.51,5.4
IN4
  Bottom 0.254: R13.1 15.24,21.49 15.24,3.56 J2.6
IN_1  (via drill 0.35)
  Top 0.254: IC1.40 31.5,33.27 v31.75,33.02
  Bottom 0.254: OK1.16 R6.2 31.54,17.88 32.38,18.73 34.92,18.73 35.88,19.68 35.88,27.62 31.75,31.75 v31.75,33.02
IN_2  (via drill 0.35)
  Top 0.254: IC1.39 31,32.66 v31.11,32.54
  Bottom 0.254: OK1.14 R8.2 | R8.2 | R8.2 31.43,20.32 32.38,21.27 34.29,21.27 35.24,22.23 35.24,27.3 31.11,31.43 v31.11,32.54
IN_3  (via drill 0.35)
  Top 0.254: IC1.38 30.5,33.11 v30.42,33.03
  Bottom 0.254: OK1.12 R10.2 | R10.2 | R10.2 31.43,22.86 32.38,23.81 34.29,23.81 34.61,24.13 34.61,26.99 30.42,31.18 v30.42,33.03
IN_4  (via drill 0.35)
  Top 0.254: IC1.37 30,33.43 29.69,33.12 v29.69,32.54
  Bottom 0.254: OK1.10 R12.2 | 31.54,25.5 R12.2 | v29.69,32.54 29.69,30.8 31.59,28.89 31.59,25.14 R12.2
M_CS  (via drill 0.35)
  Top 0.254: v15.56,31.75 v11.75,31.75 | IC1.33 27.3,33.56 v27.3,33.34
  Bottom 0.254: IC2.1 9.23,31.75 v11.75,31.75 | v27.3,33.34 26.35,32.38 18.41,32.38 17.78,31.75 v15.56,31.75
M_HLD  (via drill 0.35)
  Top 0.254: IC1.29 26.96,37.76 v27.3,38.1 | v14.92,34.61 13.97,35.56 v13.97,38.73
  Bottom 0.254: v27.3,38.1 26.67,38.1 26.04,37.47 26.04,36.83 24.45,35.24 18.73,35.24 18.41,35.24 15.56,35.24 v14.92,34.61 | v13.97,38.73 6.03,38.73 5.71,39.05 IC2.7
M_SCK  (via drill 0.35)
  Top 0.254: IC1.34 28.5,35.32 v28.26,35.56 | v15.56,32.7 7.62,32.7 4.45,35.88 v4.45,38.73
  Bottom 0.254: v28.26,35.56 25.72,33.02 18.1,33.02 17.78,32.7 v15.56,32.7 | v4.45,38.73 IC2.6
M_SI  (via drill 0.35)
  Top 0.254: IC1.36 29.5,35.27 v29.21,35.56 | v15.56,29.86 7.29,29.86 3.17,33.97 v3.17,38.73
  Bottom 0.254: v15.56,29.86 26.05,29.86 29.21,33.02 v29.21,35.56 | v3.17,38.73 IC2.5
M_SO  (via drill 0.35)
  Top 0.254: IC1.35 29,33.45 28.57,33.02 v28.26,33.02 | v15.56,30.8 7.94,30.8 v5.71,33.02
  Bottom 0.254: v28.26,33.02 26.04,30.8 v15.56,30.8 | v5.71,33.02 IC2.2
M_WP  (via drill 0.35)
  Top 0.254: IC1.30 27.3,37.26 v27.3,37.15 | v15.56,33.66 v11.75,33.66
  Bottom 0.254: v27.3,37.15 24.77,34.61 16.51,34.61 v15.56,33.66 | v11.75,33.66 10.16,33.66 8.89,34.92 5.08,34.92 4.45,34.29 IC2.3
N$1
  Top 0.254: IC1.49 38.98,36.26 40.13,37.41 41.22,37.41 41.91,38.1 41.91,40.01 DOWNLOADER.2
N$2
  Top 0.254: IC1.46 34.5,33.61 34.73,33.38 37.82,33.38 DOWNLOADER.4
N$3
  Top 0.254: C1.1 24.7,35.81 24.67,35.77 27.62,35.77 28.37,36.51 33.39,36.51 35,34.9 IC1.47
N$4
  Top 0.254: IC1.31 24.52,36.76 C2.1
N$5
  Top 0.254: IC1.7 32.5,47.74 33.66,48.9 S1.2 34.9,49.8 C8.1
N$6
  Top 0.61: R2.1 LED1.A
N$7  (via drill 0.35)
  Top 0.254: U1.34 v29.21,10.16 | v25.72,21.59 25.35,21.59 S2.2 24.13,24.55 R1.2
  Bottom 0.254: v25.72,21.59 25.72,11.43 26.99,10.16 v29.21,10.16
N$8
  Top 0.61: U1.31 26.09,14.66 25.4,13.97 R2.2
N$9
  Top 0.406: R3.2 LED2.A
N$10
  Bottom 0.254: R4.1 24.39,42.48 U2.8
N$11  (via drill 3.17)
  other vias: 2.54,51.75
N$12  (via drill 3.17)
  other vias: 37.78,51.75
N$13
  Bottom 0.254: OK1.1 R7.2
N$14  (via drill 0.35)
  Top 0.254: R14.2 21.59,9.21 v23.18,10.79
  Bottom 0.254: v23.18,10.79 23.18,10.98 U$1.1
N$16
  Bottom 0.254: OK1.3 R9.2
N$18
  Bottom 0.254: OK1.5 R11.2
N$21
  Bottom 0.254: OK1.7 R13.2
PE  (via drill 0.35)
  Top 0.254: DOWNLOADER.3 38.73,40.64 38.73,41.59 | S1.1 29.84,48.9 30,48.74 IC1.12 30,43.41 | S1.1 28.6,49.8 C8.2 30.8,52.15 v30.8,53.34 | 29.84,43.26 IC1.18 30.09,43.26 v30.16,43.18 30,43.34 30,43.41 | 29.84,43.26 IC1.63 38.34,43.26 38.73,42.86 38.73,41.91 | 30,43.41 29.84,43.26 | 21.98,29.45 22.01,29.43 | 38.73,41.91 38.73,41.59 | IC1.60 38.57,41.76 | 38.57,41.76 38.73,41.59 | v24.13,1.59 24.23,1.49 LED1.C | S1.1 v26.99,48.9 | v39.05,28.26 39.15,28.16 40.01,28.16 | U1.13 41.27,28.8 v41.27,29.21 | 38.57,41.76 38.73,41.91
  Top 0.406: 22.01,29.43 21.91,29.52 C1.2 C2.2 v21.91,41.27 v21.91,41.28 C3.2 | v13.02,40.32 11.73,40.32 IC3.1
  Top 0.61: U1.13 40.01,28.16 U1.22 23.27,28.16 v22.86,28.57 22.01,29.43 R1.1
  Top 0.813: LED2.C 6.25,42.45 6.35,42.55
  Top 1.016: 6.35,42.55 C7.- 9.09,40.28 IC3.1
  Top 1.27: 11.43,40.02 IC3.1 11.69,36.48 C6.-
  Bottom 0.254: OK1.15 27.62,18.73 | 27.62,18.73 27.62,21.27 | 27.62,21.27 27.62,23.81 | OK1.13 27.62,21.27 | OK1.11 27.62,23.81 | OK1.9 28.26,26.35 27.62,25.72 27.62,23.81 | OK1.2 23.81,18.73 | 23.81,18.73 23.94,18.86 | 23.94,18.86 24.45,19.37 24.45,21.27 | 24.45,21.27 24.45,23.81 | 24.45,23.81 24.45,25.72 23.81,26.35 OK1.8 22.86,26.42 v22.86,28.57 | OK1.6 24.45,23.81 | OK1.4 24.45,21.27 | C9.2 U2.2 28.26,39.69 27.94,40.01 27.94,43.5 27.78,43.66 R4.2 | 27.62,18.73 27.62,17.46 30.8,14.29 U$1.4 | U$1.3 23.94,18.6 | 23.94,18.6 23.81,18.73 | 23.94,18.6 23.94,18.86 | 24.45,23.81 27.62,23.81 | IC2.4 1.93,33.99 0.95,33.02 0.95,26.99 1.91,26.04 REG2.2
  Bottom 0.406: v21.91,41.27 21.86,41.33 21.01,41.33 | 20.95,41.33 21.01,41.33 | v13.02,40.32 13.65,40.96 20.64,40.96 21.01,41.33
  Bottom 0.508: v30.16,43.18 29.69,43.66 27.78,43.66
  Bottom 0.813: J2.2 11.43,11.43 9.84,13.02 6.35,13.02 | 6.35,13.02 REG1.2 | REG2.2 6.35,26.04 | 6.35,26.04 6.35,13.02 | C10.2 8.57,26.04 6.35,26.04
  other vias: 25.4,28.26 2.54,21.59 2.54,19.68 2.54,17.78 5.08,17.78 7.62,17.78 10.16,17.78 5.08,19.68 7.62,19.68 10.16,19.68 5.08,21.59 7.62,21.59 10.16,21.59 10.79,10.79 10.79,13.34 7.62,13.34 7.94,37.47 9.53,40.32 2.86,41.59 1.27,38.73 1.27,32.38
  pour Top (isolate 0.406): -2.54,6.03 10.79,6.03 11.75,6.99 11.75,22.54 12.7,23.5 12.7,41.59 9.21,41.59 7.94,42.86 -2.54,42.86
  pour Bottom (isolate 0.305): -1.27,56.2 -1.27,-1.27 27.3,-1.27 27.3,9.53 40.96,9.53 40.96,-1.27 44.45,-1.27 44.45,56.2
RPM  (via drill 0.35)
  Top 0.254: v35.88,16.51 v38.73,16.51 | IC1.15 28.5,46.43 v27.94,46.99
  Bottom 0.254: U$1.5 34.61,13.02 35.88,14.29 v35.88,16.51 | v27.94,46.99 28.89,47.94 32.38,47.94 34.92,45.4 34.92,33.66 40.32,28.26 40.32,18.1 v38.73,16.51
RPM_IN
  Top 0.406: R14.1 J2.9
RX_CAN  (via drill 0.35)
  Top 0.254: IC1.61 36.54,42.26 v33.97,39.69
  Bottom 0.254: U2.4 30.16,37.15 31.11,36.2 33.34,36.2 33.97,36.83 v33.97,39.69
RX_HC05  (via drill 0.35)
  Top 0.254: IC1.42 32.5,32.59 v32.54,32.54 | v36.83,11.75 v39.05,11.75 40.55,11.75 U1.2
  Bottom 0.254: v32.54,32.54 32.54,31.91 36.83,27.62 v36.83,11.75 | RX.1 40.01,12.7 v39.05,11.75
RX_SIM808  (via drill 0.35)
  Top 0.254: IC1.51 36.41,37.26 v36.2,37.47
  Bottom 0.254: SIM808.4 19.05,52.07 20.95,50.16 32.07,50.16 36.2,46.04 v36.2,37.47
TX_CAN  (via drill 0.35)
  Top 0.254: IC1.62 33.55,42.76 v33.34,42.55
  Bottom 0.254: v33.34,42.55 33.03,42.24 arc-90 32.58,42.24 32.35,42.47 arc90 31.9,42.47 31.9,42.47 arc90 31.9,42.02 32.13,41.79 arc-90 32.13,41.34 32.13,41.33 arc-90 31.68,41.33 31.45,41.56 arc90 31,41.56 30.39,40.96 U2.1
TX_HC05  (via drill 0.35)
  Top 0.254: IC1.43 33,33.2 v33.18,33.02 | v38.1,10.16 U1.1
  Bottom 0.254: v33.18,33.02 37.78,28.42 37.78,10.48 v38.1,10.16 TX.1
TX_SIM808  (via drill 0.35)
  Top 0.254: v38.73,37.78 38.71,37.76 IC1.52
  Bottom 0.254: SIM808.2 25.72,51.12 34.29,51.12 34.77,50.64 arc-90 34.77,50.19 34.76,50.18 arc90 34.76,49.73 34.76,49.73 arc90 35.21,49.73 35.22,49.74 arc-90 35.66,49.74 35.67,49.74 arc-90 35.67,49.29 35.66,49.28 arc90 35.66,48.83 35.66,48.83 arc90 36.11,48.83 36.12,48.84 arc-90 36.57,48.84 36.57,48.84 arc-90 36.57,48.39 36.56,48.38 arc90 36.56,47.93 36.56,47.93 arc90 37.01,47.93 37.02,47.94 arc-90 37.47,47.94 37.47,47.94 arc-90 37.47,47.49 37.46,47.48 arc90 37.46,47.03 37.46,47.03 arc90 37.91,47.03 37.92,47.04 arc-90 38.37,47.04 38.73,46.67 v38.73,37.78

### Text on the board
tNames: .
bNames: GND | CH | I4 | I2 | GND | 12V | CL | I3 | I1 | RPM | version / 20190410